# Altium schematic sheet hall_sensor_sch.SchDoc
size A; SheetNumber: 1; SheetTotal: 1
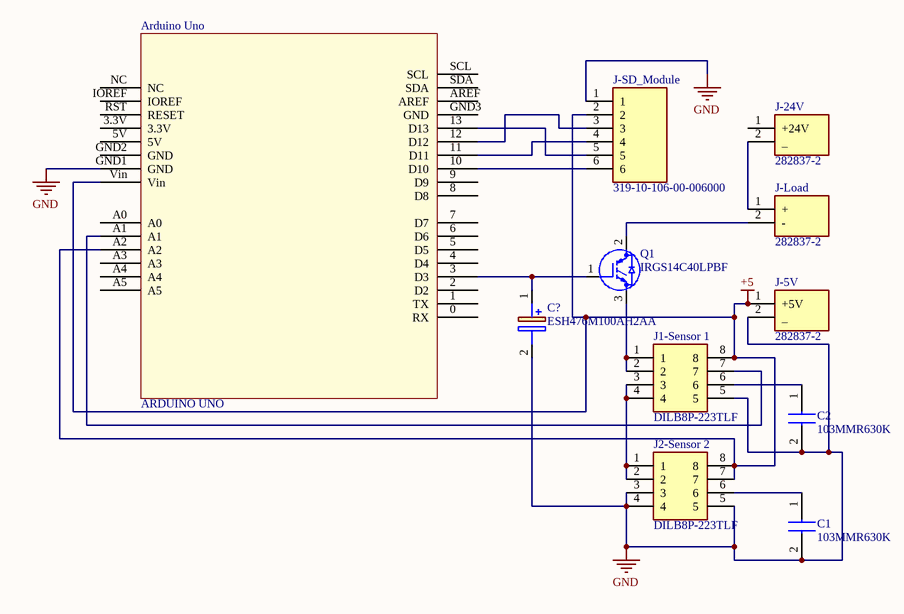
[diagram p0: hall_sensor_sch.SchDoc]

## Parts
Arduino_Uno  ARDUINO UNO  [ARDUINO UNO]
C1  103MMR630K  [103MMR630K]
C2  103MMR630K  [103MMR630K]
C?  ESH476M100AH2AA  [CAPPRD500W60D1000H1700]
J1-Sensor_1  DILB8P-223TLF  [DIPS762W60P254L1016H525Q8N]
J2-Sensor_2  DILB8P-223TLF  [DIPS762W60P254L1016H525Q8N]
J-5V  282837-2  [2828372]
J-24V  282837-2  [2828372]
J-Load  282837-2  [2828372]
J-SD_Module  319-10-106-00-006000  [RHDR6W51P0X254_1X6_1524X254X419P]
Q1  IRGS14C40LPBF  [IRF5305SPBF]

## Nets
+5: Arduino_Uno.A2 Arduino_Uno.Vin J1-Sensor_1.8 J2-Sensor_2.7 J2-Sensor_2.8 J-5V.1(+5V) J-SD_Module.2
GND: Arduino_Uno.GND1(GND) C1.2 C2.2 C?.2(-) J1-Sensor_1.5 J2-Sensor_2.3 J2-Sensor_2.4 J2-Sensor_2.5 J-5V.2(_) J-SD_Module.1
NetArduino_Uno_3: Arduino_Uno.3(D3) C?.1(+) Q1.1(G)
NetArduino_Uno_10: Arduino_Uno.10(D10) J-SD_Module.6
NetArduino_Uno_11: Arduino_Uno.11(D11) J-SD_Module.4
NetArduino_Uno_12: Arduino_Uno.12(D12) J-SD_Module.3
NetArduino_Uno_13: Arduino_Uno.13(D13) J-SD_Module.5
NetArduino_Uno_A1: Arduino_Uno.A1 J1-Sensor_1.7
NetC1_1: C1.1 J2-Sensor_2.6
NetC2_1: C2.1 J1-Sensor_1.6
NetJ1-Sensor_1_1: J1-Sensor_1.1 J1-Sensor_1.2 Q1.3(E)
NetJ1-Sensor_1_3: J1-Sensor_1.3 J1-Sensor_1.4 J2-Sensor_2.1 J2-Sensor_2.2
NetJ-24V_2: J-24V.2(_) J-Load.1(+)
NetJ-Load_2: J-Load.2(-) Q1.2(C)

Not connected (* = marked no-connect by the designer): Arduino_Uno 0(RX) 1(TX) 2(D2) 3.3V 4(D4) 5(D5) 5V 6(D6) 7(D7) 8(D8) 9(D9) A0 A3 A4 A5 AREF GND2(GND) GND3(GND) IOREF NC RST(RESET) SCL SDA; J-24V 1(+24V)

## Library data of the parts
C1 C2 = 103MMR630K: Capacitor; Manufacturer_Name: Cornell Dubilier; Datasheet Link: https://www.mouser.com/datasheet/2/88/MMR_series-553002.pdf; Height: 7.5mm; Manufacturer_Part_Number: 103MMR630K; Mouser Part Number: 598-103MMR630K; Mouser Price/Stock: https://www.mouser.co.uk/ProductDetail/Cornell-Dubilier-CDE/103MMR630K?qs=3tP%252BN51vMXcfth17WDhGLA%3D%3D
C? = ESH476M100AH2AA: Capacitor Polarised; Manufacturer_Name: KEMET; Datasheet Link: https://content.kemet.com/datasheets/KEM_A4005_ESH.pdf; Height: 17mm; Manufacturer_Part_Number: ESH476M100AH2AA; Mouser Part Number: 80-ESH476M100AH2AA; Mouser Price/Stock: https://www.mouser.co.uk/ProductDetail/KEMET/ESH476M100AH2AA?qs=T1%252BhWNR%252Bpa0giKIpYFuU0A%3D%3D
J1-Sensor_1 J2-Sensor_2 = DILB8P-223TLF: Connector; Manufacturer_Name: Amphenol; Datasheet Link: https://cdn.amphenol-cs.com/media/wysiwyg/files/drawing/10052485.pdf; Height: 5.25mm; Manufacturer_Part_Number: DILB8P-223TLF; Mouser Part Number: 649-DILB8P223TLF; Mouser Price/Stock: https://www.mouser.co.uk/ProductDetail/Amphenol-FCI/DILB8P-223TLF?qs=gISD9T5QW%2FAiSV%252BbCwW%2Fog%3D%3D; Arrow Part Number: DILB8P-223TLF; Arrow Price/Stock: https://www.arrow.com/en/products/dilb8p-223tlf/amphenol-fci?region=nac
J-5V J-24V J-Load = 282837-2: Connector; Manufacturer_Name: TE Connectivity; Datasheet Link: https://www.te.com/commerce/DocumentDelivery/DDEController?Action=srchrtrv&DocNm=1-1773458-1_EURO_STYLE_QRG&DocType=Data%20Sheet&DocLang=English&PartCntxt=282837-2&DocFormat=pdf; Height: 10.3mm; Manufacturer_Part_Number: 282837-2; Mouser Part Number: 571-2828372; Mouser Price/Stock: https://www.mouser.co.uk/ProductDetail/TE-Connectivity/282837-2?qs=A%252Bip%252BNCYi6O2H0NGWOeAxg%3D%3D; Arrow Part Number: 282837-2; Arrow Price/Stock: https://www.arrow.com/en/products/282837-2/te-connectivity?utm_currency=USD&region=europe
J-SD_Module = 319-10-106-00-006000: Connector; Manufacturer_Name: Mill-Max; Datasheet Link: https://componentsearchengine.com/Datasheets/1/319-10-106-00-006000.pdf; Height: 4.191mm; Manufacturer_Part_Number: 319-10-106-00-006000; Mouser Part Number: 575-3191010600006000; Mouser Price/Stock: https://www.mouser.co.uk/ProductDetail/Mill-Max/319-10-106-00-006000?qs=493kPxzlxfJv4%252BKSTaxzuw%3D%3D; Arrow Part Number: 319-10-106-00-006000; Arrow Price/Stock: https://www.arrow.com/en/products/319-10-106-00-006000/mill-max
Q1 = IRGS14C40LPBF: Transistor IGBT; Manufacturer_Name: Infineon; Datasheet Link: https://docs.rs-online.com/9fd5/0900766b80791357.pdf; Height: 4.83mm; Manufacturer_Part_Number: IRGS14C40LPBF; Mouser Part Number: 942-IRGS14C40LPBF; Mouser Price/Stock: https://www.mouser.co.uk/ProductDetail/Infineon-Technologies/IRGS14C40LPBF?qs=XhjApVeIGIQ%252BRl3A6Rwg0Q%3D%3D; Arrow Part Number: IRGS14C40LPBF; Arrow Price/Stock: https://www.arrow.com/en/products/irgs14c40lpbf/infineon-technologies-ag